# Altium schematic sheet black_V5.SchDoc
size A3
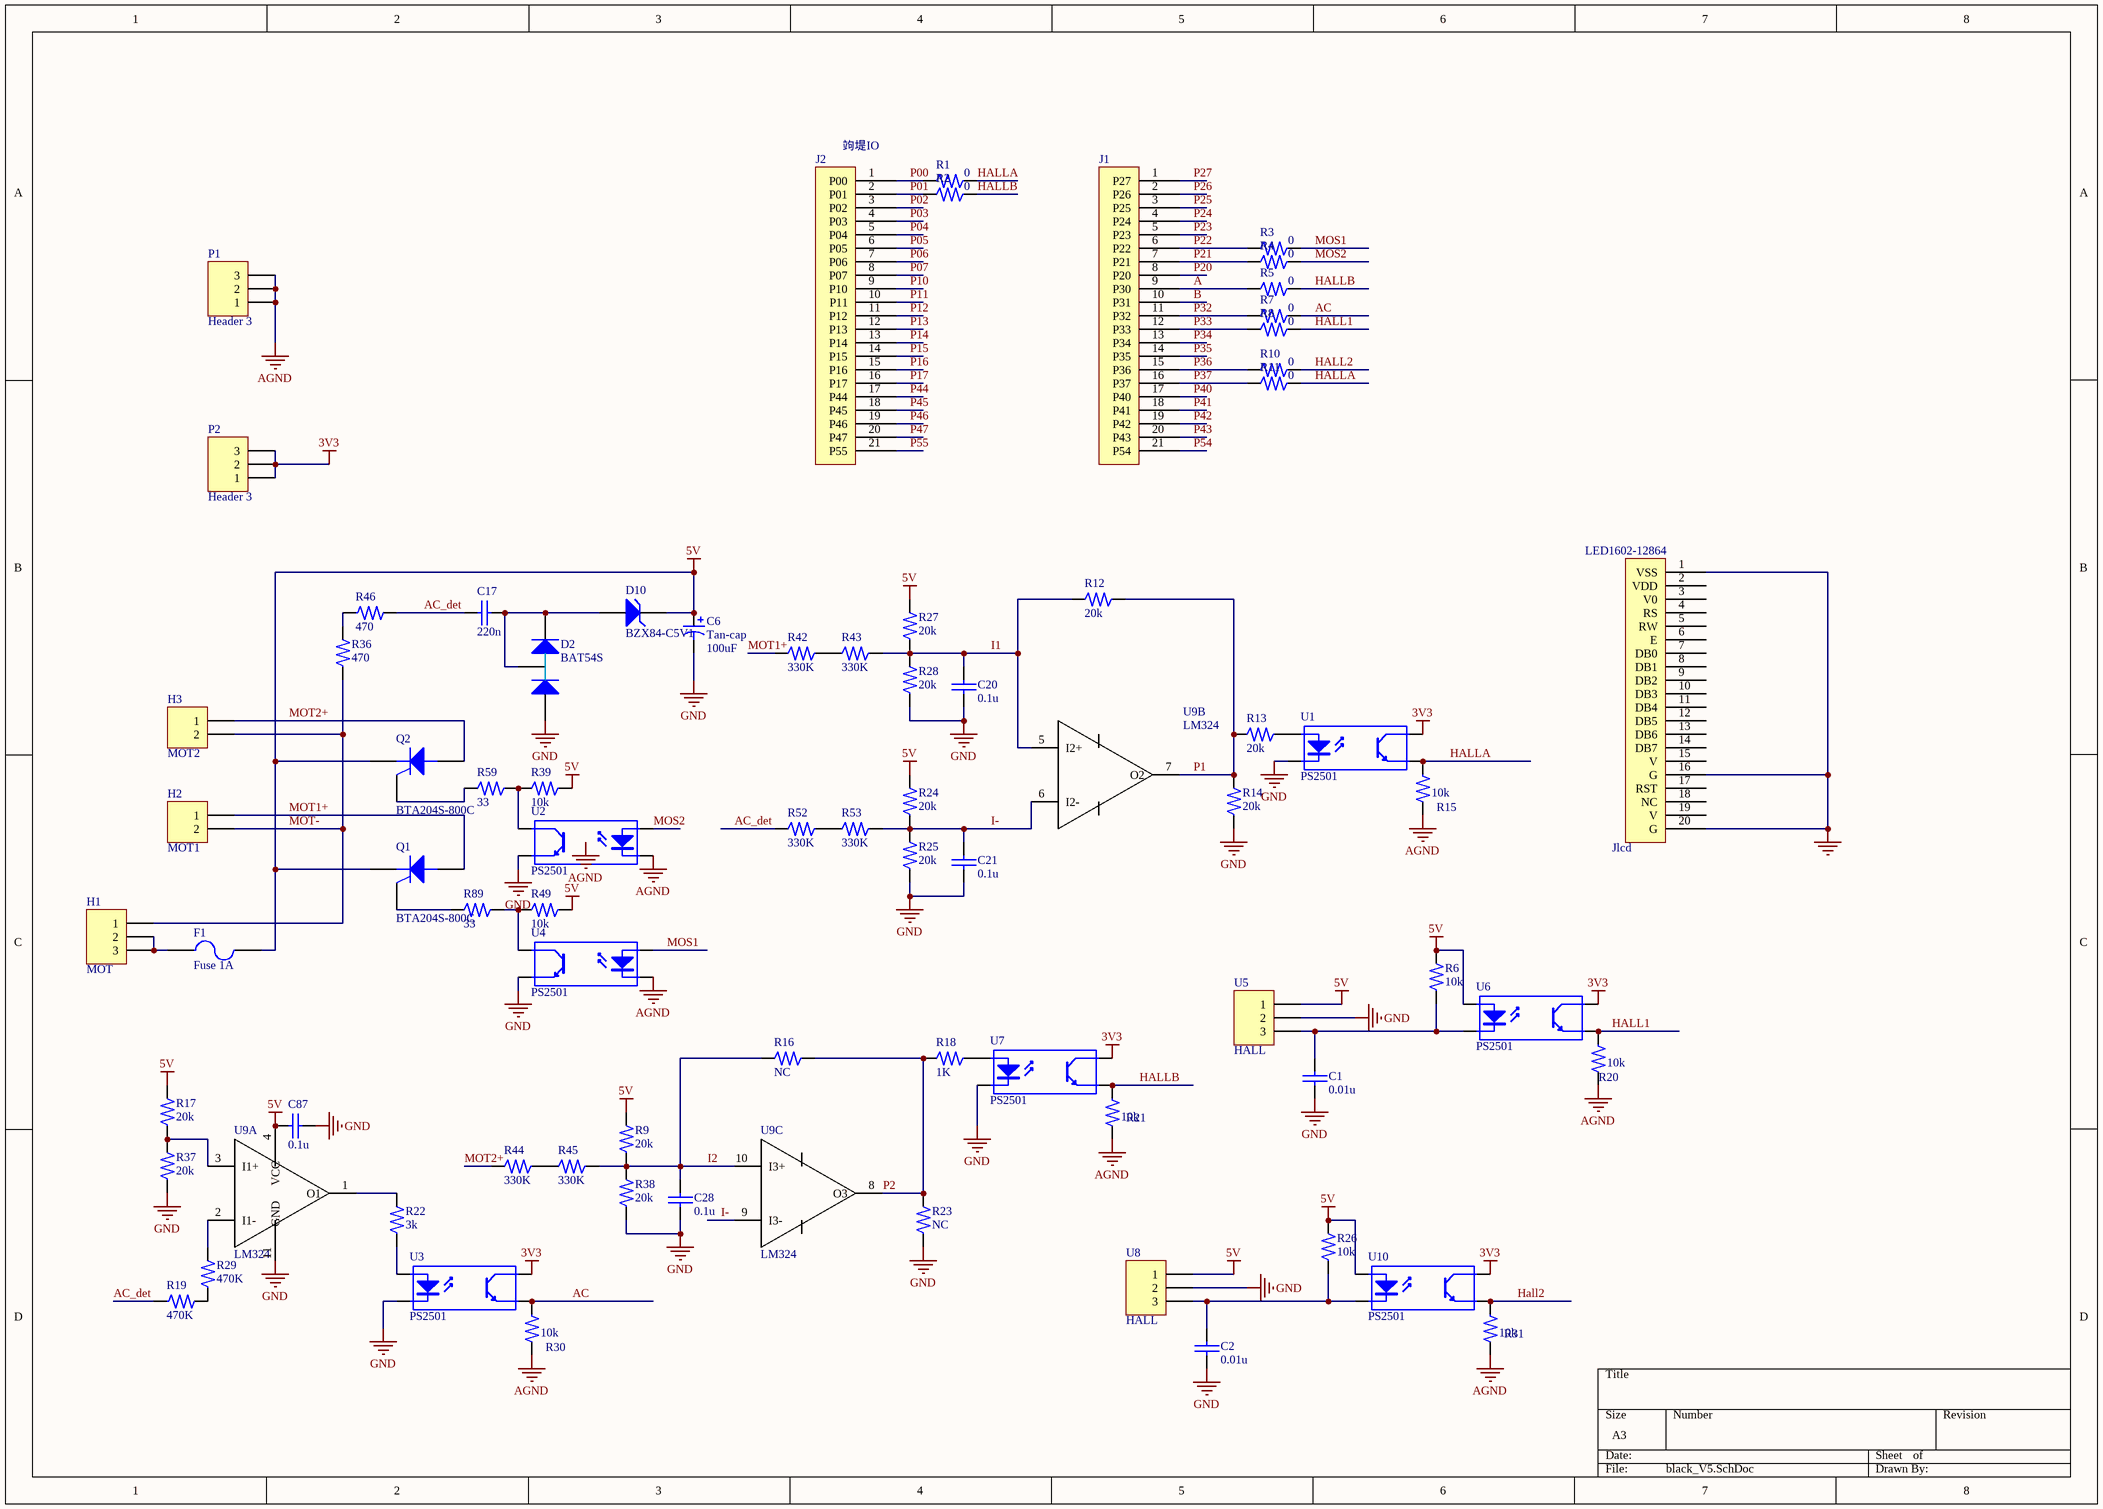
[diagram p0: black_V5.SchDoc]

## Parts
C1  0.01u  [1608[0603]]
C2  0.01u  [1608[0603]]
C6  Tan-cap  value 100uF  [ecap]
C17  220n  [filmcap]
C20  0.1u  [1608[0603]]
C21  0.1u  [1608[0603]]
C28  0.1u  [1608[0603]]
C87  0.1u  [1608[0603]]
D2  BAT54S  [SOT23_D]
D10  BZX84-C5V1  [SOT23_D]
F1  Fuse 1A  [FUSE_L]
H1  MOT  [H_3]
H2  MOT1  [MOT]
H3  MOT2  [MOT]
J1  (no value)  [J1]
J2  (no value)  [J2]
Jlcd  LED1602-12864  [jlcd]
P1  Header 3  [PP]
P2  Header 3  [PP]
Q1  BTA204S-800C  [SCR]
Q2  BTA204S-800C  [SCR]
R1  0  [R0603]
R2  0  [R0603]
R3  0  [R0603]
R4  0  [R0603]
R5  0  [R0603]
R6  10k  [R0603]
R7  0  [R0603]
R8  0  [R0603]
R9  20k  [R0603]
R10  0  [R0603]
R11  0  [R0603]
R12  20k  [R0603]
R13  20k  [R0603]
R14  20k  [R0603]
R15  10k  [R0603]
R16  NC  [R0603]
R17  20k  [R0603]
R18  1K  [R0603]
R19  470K  [R0603]
R20  10k  [R0603]
R21  10k  [R0603]
R22  3k  [R0603]
R23  NC  [R0603]
R24  20k  [R0603]
R25  20k  [R0603]
R26  10k  [R0603]
R27  20k  [R0603]
R28  20k  [R0603]
R29  470K  [R0603]
R30  10k  [R0603]
R31  10k  [R0603]
R36  470  [3216[1206]]
R37  20k  [R0603]
R38  20k  [R0603]
R39  10k  [R0603]
R42  330K  [R0603]
R43  330K  [R0603]
R44  330K  [R0603]
R45  330K  [R0603]
R46  470  [3216[1206]]
R49  10k  [R0603]
R52  330K  [R0603]
R53  330K  [R0603]
R59  33  [R0603]
R89  33  [R0603]
U1  PS2501  [DIP-4SMD]
U2  PS2501  [DIP-4SMD]
U3  PS2501  [DIP-4SMD]
U4  PS2501  [DIP-4SMD]
U5  HALL  [M1881]
U6  PS2501  [DIP-4SMD]
U7  PS2501  [DIP-4SMD]
U8  HALL  [M1881]
U9  LM324  [SOP14]  (parts A,B,C of 4)
U10  PS2501  [DIP-4SMD]

## Nets
3V3: P2.1 P2.2 P2.3 U1.4(C) U3.4(C) U6.4(C) U7.4(C) U10.4(C)
5V: C6.1 C87.2 D10.3(K) F1.1 Q1.3(K) Q2.3(K) R6.2 R9.2 R17.2 R24.2 R26.2 R27.2 R39.1 R49.1 U5.1 U6.1(A) U8.1 U9.4(VCC) U10.1(A)
AGND: P1.1 P1.2 P1.3 R15.2 R20.2 R21.2 R30.2 R31.2 U2.2(K) U4.2(K)
GND: C1.2 C2.2 C6.2 C20.2 C21.2 C28.2 C87.1 D2.1(A) Jlcd.1(VSS) Jlcd.16(G) Jlcd.20(G) R14.1 R23.1 R25.1 R28.1 R37.1 R38.1 U1.2(K) U2.3(E) U3.2(K) U4.3(E) U5.2 U7.2(K) U8.2 U9.11(GND)
A: J1.9(P30) R5.2
AC: R7.1 R30.1 U3.3(E)
AC_det: C17.1 R19.1 R46.2 R52.2
B: J1.10(P31)
HALL1: R8.1 R20.1 U6.3(E)
Hall2: R10.1 R31.1 U10.3(E)
HALLA: R1.1 R11.1 R15.1 U1.3(E)
HALLB: R2.1 R5.1 R21.1 U7.3(E)
I1: C20.1 R12.2 R27.1 R28.2 R43.1 U9.5(I2+)
I2: C28.1 R9.1 R16.2 R38.2 R45.1 U9.10(I3+)
I-: C21.1 R24.1 R25.2 R53.1 U9.6(I2-) U9.9(I3-)
MOS1: R3.1 U4.1(A)
MOS2: R4.1 U2.1(A)
MOT1+: H2.1 Q1.1(A) R42.2
MOT2+: H3.1 Q2.1(A) R44.2
MOT-: H1.1 H2.2 H3.2 R36.1
P00: J2.1(P00) R1.2
P1: R12.1 R13.2 R14.2 U9.7(O2)
P01: J2.2(P01) R2.2
P2: R16.1 R18.2 R23.2 U9.8(O3)
P02: J2.3(P02)
P03: J2.4(P03)
P04: J2.5(P04)
P05: J2.6(P05)
P06: J2.7(P06)
P07: J2.8(P07)
P10: J2.9(P10)
P11: J2.10(P11)
P12: J2.11(P12)
P13: J2.12(P13)
P14: J2.13(P14)
P15: J2.14(P15)
P16: J2.15(P16)
P17: J2.16(P17)
P20: J1.8(P20)
P21: J1.7(P21) R4.2
P22: J1.6(P22) R3.2
P23: J1.5(P23)
P24: J1.4(P24)
P25: J1.3(P25)
P26: J1.2(P26)
P27: J1.1(P27)
P32: J1.11(P32) R7.2
P33: J1.12(P33) R8.2
P34: J1.13(P34)
P35: J1.14(P35)
P36: J1.15(P36) R10.2
P37: J1.16(P37) R11.2
P40: J1.17(P40)
P41: J1.18(P41)
P42: J1.19(P42)
P43: J1.20(P43)
P44: J2.17(P44)
P45: J2.18(P45)
P46: J2.19(P46)
P47: J2.20(P47)
P54: J1.21(P54)
P55: J2.21(P55)
NetC1_1: C1.1 R6.1 U5.3 U6.2(K)
NetC2_1: C2.1 R26.1 U8.3 U10.2(K)
NetC17_2: C17.2 D2.2(K) D2.3(S) D10.1(A)
NetF1_2: F1.2 H1.2 H1.3
NetQ1_2: Q1.2(G) R89.2
NetQ2_2: Q2.2(G) R59.2
NetR13_1: R13.1 U1.1(A)
NetR17_1: R17.1 R37.2 U9.3(I1+)
NetR18_1: R18.1 U7.1(A)
NetR19_2: R19.2 R29.1
NetR22_1: R22.1 U3.1(A)
NetR22_2: R22.2 U9.1(O1)
NetR29_2: R29.2 U9.2(I1-)
NetR36_2: R36.2 R46.1
NetR39_2: R39.2 R59.1 U2.4(C)
NetR42_1: R42.1 R43.2
NetR44_1: R44.1 R45.2
NetR49_2: R49.2 R89.1 U4.4(C)
NetR52_1: R52.1 R53.2

Not connected (* = marked no-connect by the designer): Jlcd 2(VDD) 3(V0) 4(RS) 5(RW) 6(E) 7(DB0) 8(DB1) 9(DB2) 10(DB3) 11(DB4) 12(DB5) 13(DB6) 14(DB7) 15(V) 17(RST) 18(NC) 19(V)

## Notes on the sheet
- (near J2) 竘堤IO
- Labels drawn without touching a wire or pin: AGND

## Library data of the parts
C1 C2 C17 C20 C21 C28 C87 = CAP NP: CAP NL; manufacturer: Yageo; part number: CC0603KRX7R9BB103; remark: C-CAP 10N 50V X7R  0603 K
C6 = Cap Pol1: Polarized Capacitor (Radial); Published: 8-Jun-2000; LatestRevisionDate: 17-Jul-2002; LatestRevisionNote: Re-released for DXP Platform.; PackageReference: RB7.6-15; Publisher: Altium Limited
D2 = BAT54S: Manufacturer: Vishay; Digikey: http://www.digikey.com/product-detail/en/BAT54S-HE3-18/BAT54S-HE3-18-ND/4826904; Part: BAT54s; Package: SOT23; Cost: 0.04
D10 = D Zener: Zener Diode; Manufacturer: NXP; Published: 8-Jun-2000; LatestRevisionDate: 17-Jul-2002; LatestRevisionNote: Re-released for DXP Platform.; PackageReference: DIODE-0.7; Publisher: Altium Limited; Digikey: http://www.digikey.com/product-detail/en/BZX84-C5V1,215/568-1677-2-ND/763281; Part: BZX84-C5V1; Package: SOT23; Cost: 0.02
F1 = Fuse 2: Fuse; Part: 0251001MXL; Manufacturer: Littelfuse; Published: 8-Jun-2000; LatestRevisionDate: 17-Jul-2002; LatestRevisionNote: Re-released for DXP Platform.; PackageReference: PIN-W2/E2.8; Publisher: Altium Limited; Digikey: http://www.digikey.com/product-detail/en/0251001.MXL/F2313-ND/700718; Package: Axial; Cost: 0.3
H1 = Header 3: Header, 3-Pin; Part: US1881; Manufacturer: Melexis; LatestRevisionDate: 17-Jul-2002; LatestRevisionNote: Re-released for DXP Platform.; Publisher: Altium Limited; Digikey: http://www.digikey.com/product-detail/en/US1881EUA-AAA-000-BU/US1881EUA-AAA-000-BU-ND/431867; Package: TO-92; Cost: 0.4
H2 H3 = Header 2: Header, 2-Pin; LatestRevisionDate: 17-Jul-2002; LatestRevisionNote: Re-released for DXP Platform.; Publisher: Altium Limited
J1 = P152
J2 = P151
P1 P2 U5 U8 = Header 3: Header, 3-Pin; LatestRevisionDate: 17-Jul-2002; LatestRevisionNote: Re-released for DXP Platform.; Publisher: Altium Limited
Q1 Q2 = SCR: Silicon Controlled Rectifier; Manufacturer: NXP; Published: 8-Jun-2000; LatestRevisionDate: 17-Jul-2002; LatestRevisionNote: Re-released for DXP Platform.; PackageReference: TO-220-AB; Publisher: Altium Limited; Code_JEDEC: TO-220-AB; Digikey: http://www.digikey.com/product-detail/en/BTA204S-800C,118/568-9608-2-ND/1155228; Part: BTA204S-800C; Package: DPAK; Cost: 0.24
R1-R31 R36-R39 R42-R46 R49 R52 R53 R59 R89 = RES: manufacturer: Yageo; part number: RC0603JR-071KL; remark: RES-TF 1K  0.1W 0603 5%
U1-U4 U6 U7 U10 = Optoisolator1: 4-Pin Phototransistor Optocoupler; Published: 24-Mar-1999; LatestRevisionDate: 04-Mar-2005; LatestRevisionNote: Sch pins 3 & 4 Swapped.; DatasheetDocument: Nov-2003; PackageReference: DIP-4; Publisher: Altium Limited